# EAGLE design Netzteil_5V (EAGLE 7.2.0)
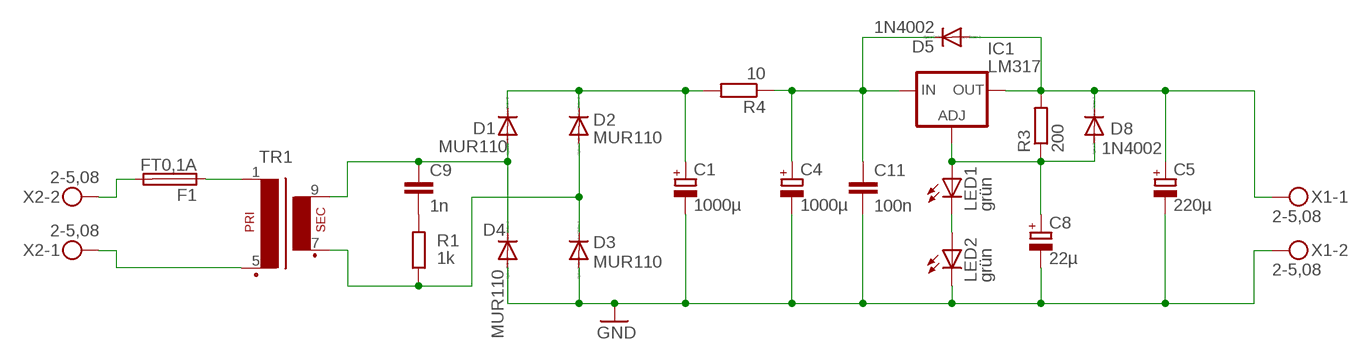
[diagram p0: schematic, sheet 1]

## Parts
C1  1000µ  CPOL-EUE5-13  [E5-13]
C4  1000µ  CPOL-EUE5-13  [E5-13]
C5  220µ  CPOL-EUE3.5-8  [E3,5-8]
C8  22µ  CPOL-EUE2-5  [E2-5]
C9  1n  C-EU050-045X075  [C050-045X075]
C11  100n  C-EU050-025X075  [C050-025X075]
D1  MUR110  MUR150RL  [DO41-10]
D2  MUR110  MUR150RL  [DO41-10]
D3  MUR110  MUR150RL  [DO41-10]
D4  MUR110  MUR150RL  [DO41-10]
D5  1N4002  MUR150RL  [DO41-10]
D8  1N4002  MUR150RL  [DO41-10]
F1  FT0,1A  FUSE19560  [19560]
IC1  LM317  LM317TS  [317TS]
LED1  grün  LED3MM  [LED3MM]
LED2  grün  LED3MM  [LED3MM]
R1  1k  R-EU_0207/10  [0207/10]
R3  200  R-EU_0207/10  [0207/10]
R4  10  R-EU_0617/5V  [0617V]
TR1  EI38-1  [EI38-1]
X1  2-5,08  MKDSN1,5/2-5,08  [MKDSN1,5/2-5,08]
X2  2-5,08  MKDSN1,5/2-5,08  [MKDSN1,5/2-5,08]

## Nets
GND: C1.- C4.- C5.- C8.- C11.2 D3.A D4.A LED2.K(C) X1.2
N$1: F1.2 X2.2
N$2: F1.1 TR1.1
N$3: TR1.5(P2) X2.1
N$4: LED1.K(C) LED2.A
N$5: C9.2 R1.2
N$6: C9.1 D1.A D4.C TR1.9(S4)
N$7: D2.A D3.C R1.1 TR1.7(S3)
N$9: C1.+ D1.C D2.C R4.2
N$12: C4.+ C11.1 D5.C IC1.3(IN) R4.1
N$14: C8.+ D8.A IC1.1(ADJ) LED1.A R3.1
N$19: C5.+ D5.A D8.C IC1.2(OUT) R3.2 X1.1

## Library data of the parts
C1 C4 C5 C8 = rcl:CPOL-EU: POLARIZED CAPACITOR, European symbol
C9 C11 = resistor:C-EU: CAPACITOR, European symbol
D1-D5 D8 = diode:MUR150RL: DIODE
F1 = fuse:FUSE: Fuse; MPN: 56000001009; OC_FARNELL: 1185363; OC_NEWARK: 98K6125
IC1 = v-reg:LM317TS: VOLTAGE REGULATOR
LED1 LED2 = led:LED: LED OSRAM: - CHIPLED LG R971, LG N971, LY N971, LG Q971, LY Q971, LO R971, LY R971 LH N974, LH R974 LS Q976, LO Q976, LY Q976 LO Q996 - Hyper CHIPLED LW Q18S LB Q993, LB Q99A, LB R99A - SideLED LS A670, LO A670, LY A670, LG A670, LP A670 LB A673, LV A673, LT A673, LW A673 LH A674 LY A675 LS A676, LA A676, LO A676, LY A676, LW A676 LS A679, LY A679, LG A679 - Hyper Micro SIDELED® LS Y876, LA Y876, LO Y876, LY Y876 LT Y87S - SmartLED LW L88C, LW L88S LB L89C, LB L89S, LG L890 LS L89K, LO L89K, LY L89K LS L896, LA L896, LO L896, LY L896 - TOPLED LS T670, LO T670, LY T670, LG T670, LP T670 LSG T670, LSP T670, LSY T670, LOP T670, LYG T670 LG T671, LOG T671, LSG T671 LB T673, LV T673, LT T673, LW T673 LH T674 LS T676, LA T676, LO T676, LY T676, LB T676, LH T676, LSB T676, LW T676 LB T67C, LV T67C, LT T67C, LS T67K, LO T67K, LY T67K, LW E67C LS E67B, LA E67B, LO E67B, LY E67B, LB E67C, LV E67C, LT E67C LW T67C LS T679, LY T679, LG T679 LS T770, LO T770, LY T770, LG T770, LP T770 LB T773, LV T773, LT T773, LW T773 LH T774 LS E675, LA E675, LY E675, LS T675 LS T776, LA T776, LO T776, LY T776, LB T776 LHGB T686 LT T68C, LB T68C - Hyper Mini TOPLED® LB M676 - Mini TOPLED Santana® LG M470 LS M47K, LO M47K, LY M47K Source: http://www.osram.convergy.de LUXEON: - LUMILED® LXK2-PW12-R00, LXK2-PW12-S00, LXK2-PW14-U00, LXK2-PW14-V00 LXK2-PM12-R00, LXK2-PM12-S00, LXK2-PM14-U00 LXK2-PE12-Q00, LXK2-PE12-R00, LXK2-PE12-S00, LXK2-PE14-T00, LXK2-PE14-U00 LXK2-PB12-K00, LXK2-PB12-L00, LXK2-PB12-M00, LXK2-PB14-N00, LXK2-PB14-P00, LXK2-PB14-Q00 LXK2-PR12-L00, LXK2-PR12-M00, LXK2-PR14-Q00, LXK2-PR14-R00 LXK2-PD12-Q00, LXK2-PD12-R00, LXK2-PD12-S00 LXK2-PH12-R00, LXK2-PH12-S00 LXK2-PL12-P00, LXK2-PL12-Q00, LXK2-PL12-R00 Source: www.luxeon.com KINGBRIGHT: KA-3528ASYC Source: www.kingbright.com
R1 R3 R4 = resistor:R-EU_: RESISTOR, European symbol
TR1 = trafo:EI38-1: TRANSFORMER 1 primary winding, 1 secondary winding ERA
X1 X2 = con-phoenix-508:MKDSN1,5/2-5,08: MKDSN 1,5/ 2-5,08 Printklemme Nennstrom: 13,5 A Nennspannung: 250 V Rastermaß: 5,08 mm Polzahl: 2 Anschlussart: Schraubanschluss Montage: Löten Anschlussrichtung Leiter/Platine: 0 ° Artikelnummer: 1729128 Source: http://eshop.phoenixcontact.com .. 1729128.pdf

## Board
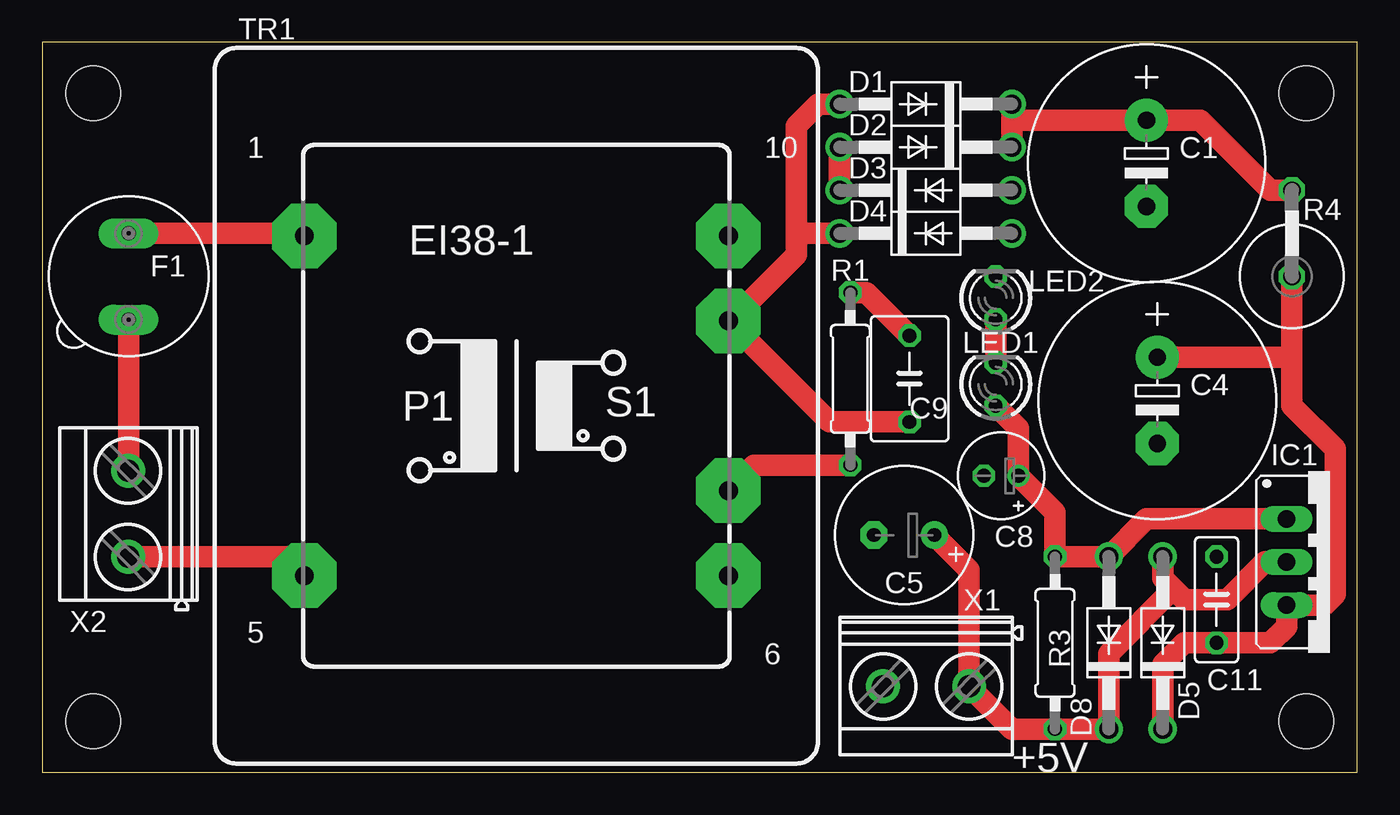
[diagram p1: board, top side]
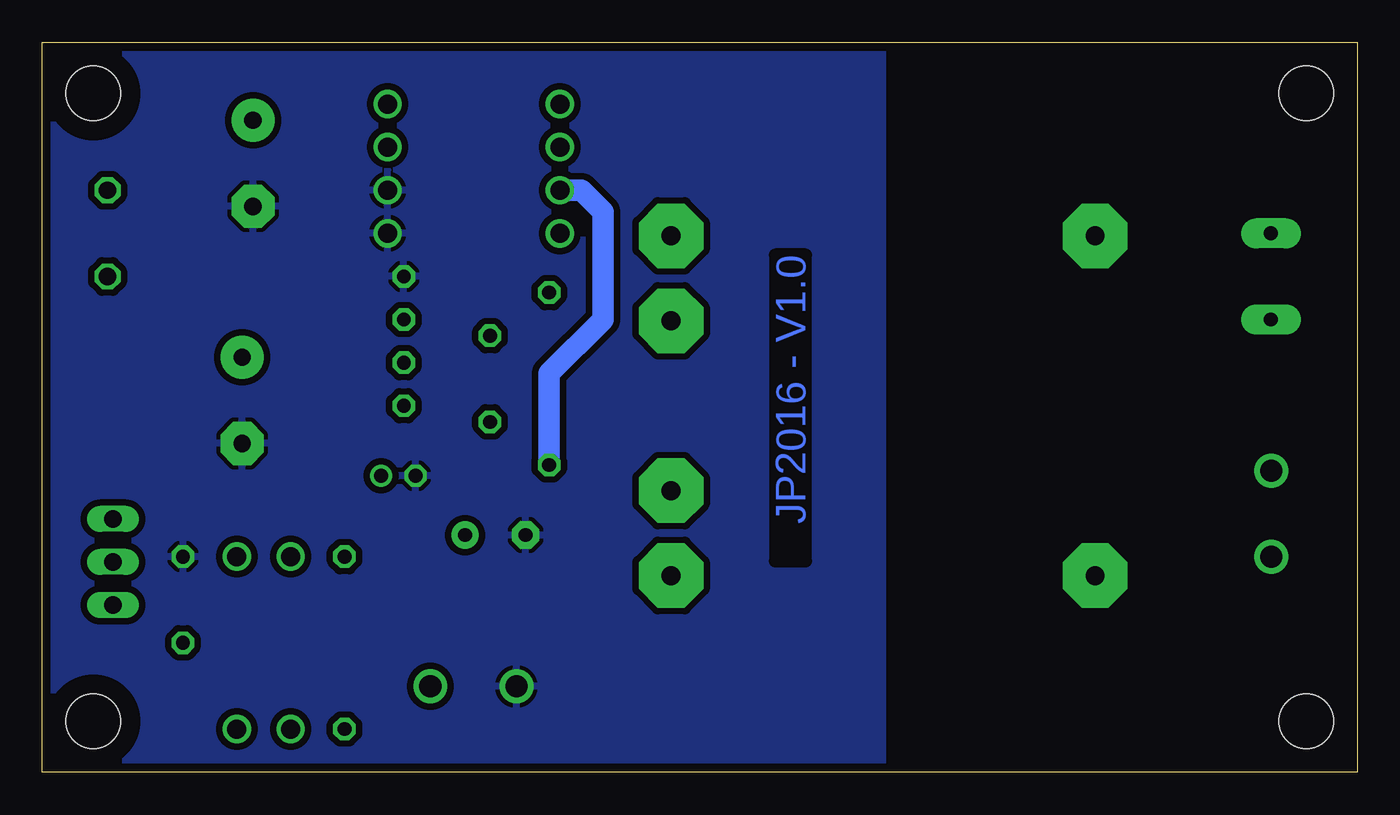
[diagram p2: board, bottom side, seen from below]

Size 77.5 x 43 mm. Coordinates in mm from the lower left corner, seen from the top.
Outline: 0,0 77.5,0 77.5,43 0,43 0,0
Copper layers (1*16): Top 0.035mm / dielectric 1.5mm / Bottom 0.035mm
Design rules "EagleRules *": minimum track width 7mil, minimum drill 12mil, track to track 15mil, track to pad 10mil, pad to pad 7mil, via to via 7mil, smd to smd 0mil, copper to edge 20mil, drill to drill 10mil, minimum pad ring 10mil, minimum via ring 6mil, stop-mask expansion 2mil, vias tented up to drill 25mil, thermal gap 10mil
Holes 3.2 mm at 3,40 3,3 74.5,3 74.5,40
bRestrict: area 0.2,37.2 to 5.8,42.8; area 71.8,37.2 to 77.2,42.8; area 71.8,0.2 to 77.2,5.8; area 0.2,0.2 to 5.8,5.8

### Footprints (pad centres in the part's own frame; a part is rotated, then mirrored left to right if it is on the bottom)
E5-13 = drill 1.016 pad 2.54: + -2.54,0 | drill 1.016 pad 2.54 octagon: - 2.54,0
E3,5-8 = drill 0.813 pad 1.6: + -1.778,0 | drill 0.813 pad 1.6 octagon: - 1.778,0
E2-5 = drill 0.813 pad 1.27: + -1.016,0 | drill 0.813 pad 1.27 octagon: - 1.016,0
C050-045X075 = drill 0.813 octagon: 1 -2.54,0; 2 2.54,0
C050-025X075 = drill 0.813 octagon: 1 -2.54,0; 2 2.54,0
DO41-10 = drill 1.118: A 5.08,0; C -5.08,0
19560 = drill 0.813 pad 1.778 long: 1 -2.54,0; 2 2.54,0
317TS = drill 1.016 long: 1 -2.54,-2.54; 2 0,-2.54; 3 2.54,-2.54
LED3MM = drill 0.813 octagon: A -1.27,0; K 1.27,0
0207/10 = drill 0.813 octagon: 1 -5.08,0; 2 5.08,0
0617V = drill 1.016 octagon: 1 -2.54,0; 2 2.54,0
EI38-1 = drill 1.118 pad 3.81 octagon: 1 -12.497,10.008; 5 -12.497,-10.008; 6 12.497,-10.008; 7 12.497,-5.004; 9 12.497,5.004; 10 12.497,10.008
MKDSN1,5/2-5,08 = drill 1.3 pad 2: 1 -2.561,0.025; 2 2.519,0.025

### Placement (x,y rotation side)
C1  65.09,35.88 270 top
C4  65.72,21.91 270 top
C5  50.8,13.97 180 top
C8  56.52,17.46 180 top
C9  51.12,23.18 90 top
C11  69.22,10.16 90 top
D1  52.07,39.37 180 top
D2  52.07,36.83 180 top
D3  52.07,34.29 0 top
D4  52.07,31.75 0 top
D5  66.04,7.62 90 top
D8  62.87,7.62 90 top
F1  5.08,29.21 270 top
IC1  75.88,12.38 270 top
LED1  56.2,22.86 90 top
LED2  56.2,27.94 90 top
R1  47.62,23.18 90 top
R3  59.69,7.62 270 top
R4  73.66,31.75 90 top
TR1  27.94,21.59 0 top
X1  52.07,5.08 180 top
X2  5.08,15.24 90 top

### Tracks (layer width: path | path; a pad name or v marks a point on that pad's centre or on a via)
GND
  pour Bottom: 27.94,43 77.47,43 77.47,0 27.94,0
N$1
  Top 1.27: F1.2 5.08,19.05 X2.2
N$2
  Top 1.27: F1.1 15.29,31.75 TR1.1
N$3
  Top 1.27: X2.1 14.35,12.68 TR1.5
N$4
  Top 1.27: LED2.A LED1.K
N$5
  Top 1.27: R1.2 48.58,28.26 C9.2
N$6
  Top 1.27: 44.45,31.75 44.45,30.48 41.83,27.86 TR1.9 46.39,20.64 C9.1 | 44.45,31.75 44.45,38.1 45.72,39.37 D1.A | D4.C 44.45,31.75
N$7
  Top 1.27: D2.A D3.C | R1.1 41.95,18.1 TR1.7
  Bottom 1.27: R1.1 47.62,23.5 44.45,26.67 44.45,33.02 45.72,34.29 D3.C
N$9
  Top 1.27: D2.C 57.15,38.1 | 57.15,38.1 D1.C | 57.15,38.1 57.47,38.42 C1.+ 68.26,38.42 72.39,34.29 R4.2
N$12
  Top 1.27: R4.1 73.66,24.13 | 73.66,24.13 73.66,21.59 76.2,19.05 76.2,10.48 75.56,9.84 IC1.3 73.34,8.57 72.39,7.62 C11.1 67.31,7.62 66.04,6.35 D5.C | C4.+ 73.34,24.45 73.66,24.13
N$14
  Top 1.27: IC1.1 65.09,14.92 D8.A R3.1 59.69,15.3 C8.+ 57.53,20.26 LED1.A
N$19
  Top 1.27: C5.+ 54.63,11.92 X1.1 57.15,2.54 R3.2 D8.C 62.87,6.99 66.67,10.79 | D5.A 66.04,11.43 66.67,10.79 | 66.67,10.79 67.31,10.16 69.85,10.16 72.07,12.38 IC1.2

### Text on the board
Bottom: JP2016 - V1.0
tNames: +5V